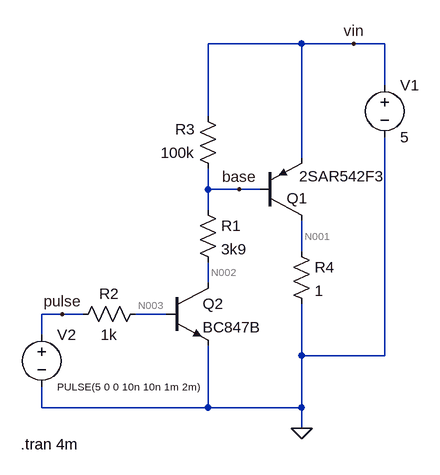
[diagram p0: schematic 09-pnp_linear_switch.asc]
09-pnp_linear_switch.asc, the LTspice schematic file:
Version 4
SHEET 1 880 680
WIRE 304 -48 160 -48
WIRE 384 -48 304 -48
WIRE 432 -48 384 -48
WIRE 432 16 432 -48
WIRE 160 64 160 -48
WIRE 304 128 304 -48
WIRE 160 176 160 144
WIRE 208 176 160 176
WIRE 240 176 208 176
WIRE 160 208 160 176
WIRE 304 272 304 224
WIRE 160 320 160 288
WIRE -64 368 -96 368
WIRE -32 368 -64 368
WIRE 96 368 48 368
WIRE -96 400 -96 368
WIRE 304 432 304 352
WIRE 432 432 432 96
WIRE 432 432 304 432
WIRE -96 512 -96 480
WIRE 160 512 160 416
WIRE 160 512 -96 512
WIRE 304 512 304 432
WIRE 304 512 160 512
WIRE 304 544 304 512
FLAG 304 544 0
FLAG -64 368 pulse
FLAG 208 176 base
FLAG 384 -48 vin
SYMBOL pnp 240 224 M180
WINDOW 0 41 34 Left 2
WINDOW 3 60 68 Left 2
SYMATTR InstName Q1
SYMATTR Value 2SAR542F3
SYMBOL voltage 432 0 R0
WINDOW 123 0 0 Left 0
WINDOW 39 0 0 Left 0
SYMATTR InstName V1
SYMATTR Value 5
SYMBOL npn 96 320 R0
SYMATTR InstName Q2
SYMATTR Value BC847B
SYMBOL res 144 192 R0
SYMATTR InstName R1
SYMATTR Value 3k9
SYMBOL res 64 352 R90
WINDOW 0 0 56 VBottom 2
WINDOW 3 32 56 VTop 2
SYMATTR InstName R2
SYMATTR Value 1k
SYMBOL res 176 160 R180
WINDOW 0 36 76 Left 2
WINDOW 3 36 40 Left 2
SYMATTR InstName R3
SYMATTR Value 100k
SYMBOL voltage -96 384 R0
WINDOW 3 24 96 Left 1
WINDOW 123 0 0 Left 0
WINDOW 39 0 0 Left 0
SYMATTR InstName V2
SYMATTR Value PULSE(5 0 0 10n 10n 1m 2m)
SYMBOL res 288 256 R0
SYMATTR InstName R4
SYMATTR Value 1
TEXT -128 568 Left 2 !.tran 4m

The netlist it stands for:
* 09-pnp_linear_switch.asc
Q1 N001 base vin 0 2SAR542F3
V1 vin 0 5
Q2 N002 N003 0 0 BC847B
R1 base N002 3k9
R2 N003 pulse 1k
R3 base vin 100k
V2 pulse 0 PULSE(5 0 0 10n 10n 1m 2m)
R4 N001 0 1
.model NPN NPN
.model PNP PNP
.lib standard.bjt
.tran 4m
.backanno
.end

* Results of the author's LTspice run, read from the files saved beside the schematic
* Operating Point, zero values left out:
*   V(n001) = 347.9 mV
*   V(base) = 4.303 V
*   V(vin) = 5 V
*   V(n002) = 7.15 mV
*   V(n003) = 763.9 mV
*   V(pulse) = 5 V
*   Ic(Q1) = -347.9 mA
*   Ib(Q1) = -1.094 mA
*   Ie(Q1) = 349 mA
*   Ic(Q2) = 1.101 mA
*   Ib(Q2) = 4.236 mA
*   Ie(Q2) = -5.338 mA
*   I(R1) = 1.101 mA
*   I(R2) = -4.236 mA
*   I(R3) = -6.972 µA
*   I(R4) = 347.9 mA
*   I(V1) = -349 mA
*   I(V2) = -4.236 mA
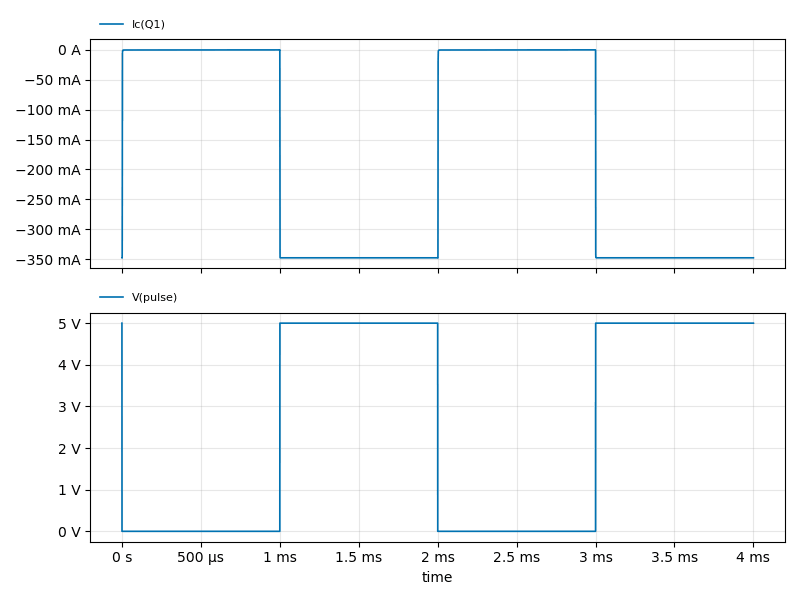
[diagram p1: Transient Analysis of 09-pnp_linear_switch.asc, plotted from the saved traces]
* Transient Analysis, 1 run:
*   Ic(Q1): min -348.2 mA, max 239.9 µA, average -174.3 mA, rms 246.2 mA, last -347.9 mA
*   V(pulse): min 0 V, max 5 V, average 2.5 V, rms 3.536 V, last 5 V